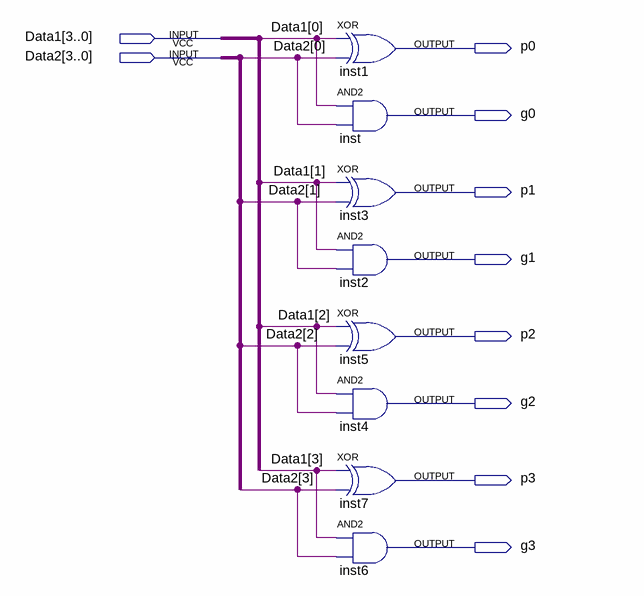
[diagram p0: schematic sheet]
// Quartus schematic add4_pg_generator.bdf as structural Verilog: 8 symbols, 10 pins
module add4_pg_generator (
  input  [3:0] Data1,
  input  [3:0] Data2,
  output p0,
  output g0,
  output p1,
  output g1,
  output p2,
  output g2,
  output p3,
  output g3
);

  xor inst1 (p0, Data1[0], Data2[0]);
  and inst (g0, Data1[0], Data2[0]);
  xor inst3 (p1, Data1[1], Data2[1]);
  and inst2 (g1, Data1[1], Data2[1]);
  xor inst5 (p2, Data1[2], Data2[2]);
  and inst4 (g2, Data1[2], Data2[2]);
  xor inst7 (p3, Data1[3], Data2[3]);
  and inst6 (g3, Data1[3], Data2[3]);
endmodule
